# Altium project Interface Panel(Display).PrjPcb
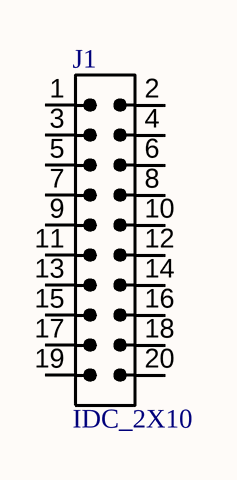
[diagram p0: JTAG.SchDoc]
4 sheets, 26 parts. Net scope: global (net labels, ports and power ports of the same name join across sheets).
Board file: PCB_V0.0.PcbDoc
Sheets:
  JTAG.SchDoc
  Disp.SchDoc
  screw and Hole.SchDoc
  On Board Terminal.SchDoc

## Sheet JTAG.SchDoc
size 297 x 209 mm; SheetNumber: 1; SheetTotal: 3

### Parts
J1  IDC_2X10  [IDC_2X10]

### Nets

Not connected (* = marked no-connect by the designer): J1 1 2 3 4 5 6 7 8 9 10 11 12 13 14 15 16 17 18 19 20

### Notes on the sheet
- Drawn
- Name
- Date
- Drawing Title
- Checked
- Drawing No.
- Approved
- Size
- A4
- Ver.
- Rev.
- Sheet
- Of

### Library data of the parts
J1 = IDC_2X10: CONN, IDC, Male, pitch: 2.54mm, 20POS; VALUE: IDC_2X10

## Sheet Disp.SchDoc
size 297 x 209 mm; SheetNumber: 2; SheetTotal: 4
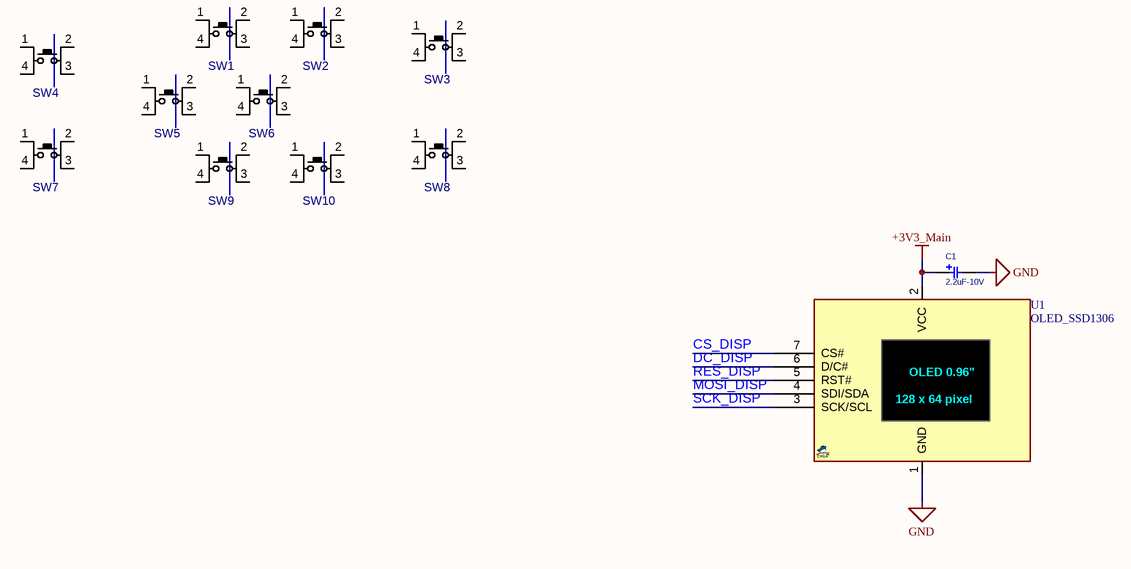
[diagram p1: Disp.SchDoc]

### Parts
C1  2.2uF-10V  [C_TN_3216]
SW1  PUSHBUTTON  [SWPBS_SPDT_6X6X4]  (value not drawn)
SW2  PUSHBUTTON  [SWPBS_SPDT_6X6X4]  (value not drawn)
SW3  PUSHBUTTON  [SWPBS_SPDT_6X6X4]  (value not drawn)
SW4  PUSHBUTTON  [SWPBS_SPDT_3X3TS]  (value not drawn)
SW5  PUSHBUTTON  [SWPBS_SPDT_6X6X4]  (value not drawn)
SW6  PUSHBUTTON  [SWPBS_SPDT_6X6X4]  (value not drawn)
SW7  PUSHBUTTON  [SWPBS_SPDT_3X3TS]  (value not drawn)
SW8  PUSHBUTTON  [SWPBS_SPDT_6X6X4]  (value not drawn)
SW9  PUSHBUTTON  [SWPBS_SPDT_6X6X4]  (value not drawn)
SW10  PUSHBUTTON  [SWPBS_SPDT_6X6X4]  (value not drawn)
U1  OLED_SSD1306  [OLED_SSD1306_64_SPI]

### Nets
+3V3_Main: C1.1 U1.2(VCC)
GND: C1.2 U1.1(GND)
CS_DISP: U1.7(CS#)
DC_DISP: U1.6(D/C#)
MOSI_DISP: U1.4(SDI/SDA)
RES_DISP: U1.5(RST#)
SCK_DISP: U1.3(SCK/SCL)

Not connected (* = marked no-connect by the designer): SW1 1(P1) 2(P3) 3(P4) 4(P2); SW2 1(P1) 2(P3) 3(P4) 4(P2); SW3 1(P1) 2(P3) 3(P4) 4(P2); SW4 1(P1) 2(P3) 3(P4) 4(P2); SW5 1(P1) 2(P3) 3(P4) 4(P2); SW6 1(P1) 2(P3) 3(P4) 4(P2); SW7 1(P1) 2(P3) 3(P4) 4(P2); SW8 1(P1) 2(P3) 3(P4) 4(P2); SW9 1(P1) 2(P3) 3(P4) 4(P2); SW10 1(P1) 2(P3) 3(P4) 4(P2)

### Notes on the sheet
- Drawn
- Name
- Date
- Drawing Title
- Checked
- Drawing No.
- Approved
- Size
- A4
- Ver.
- Rev.
- Sheet
- Of
- (in symbol OLED_SSD1306_64_SPI) OLED 0.96"; 128 x 64 pixel

### Library data of the parts
C1 = CAP_SMD_TAN: CAP, SMD, TAN,; PARAM2: -V; VALUE: 2.2uF-10V
SW1-SW3 SW5 SW6 SW8-SW10 = SWPBS_SPDT_6X6X4: SWITCH, PUSH BUTTON, TACTILE, SMD, SPDT, 6X6X4.3mm; MANF: Bond-Tact; DESC: DESCRIPTION; MANF_P#: TS-1143S; VALUE: PUSHBUTTON; ASSEMBLY: ASSEMBLY; PARAM: PARAM; PRICE: PRICE
SW4 SW7 = SWPBS_SPDT_3X3TS: SWITCH, PUSH BUTTON, TACTILE, SMD, SPDT, 3X3MM; MANF: CHINA; DESC: DESCRIPTION; MANF_P#: TS-1233; VALUE: PUSHBUTTON; ASSEMBLY: ASSEMBLY; PARAM: PARAM; PRICE: 1000= 5$
U1 = OLED_SSD1306_64_SPI: OLED, SSD1306, 0.96", 128X64, BREAKOUT SPI; MANF_P#: OLED_SSD1306_I2C; PARAM2: 3.3/5VCC, -20~70oC; PARAM: 2 Colors, 0.96", 128X64; MANF: -; VALUE: OLED_SSD1306

## Sheet screw and Hole.SchDoc
size 297 x 209 mm; SheetNumber: 3; SheetTotal: 4
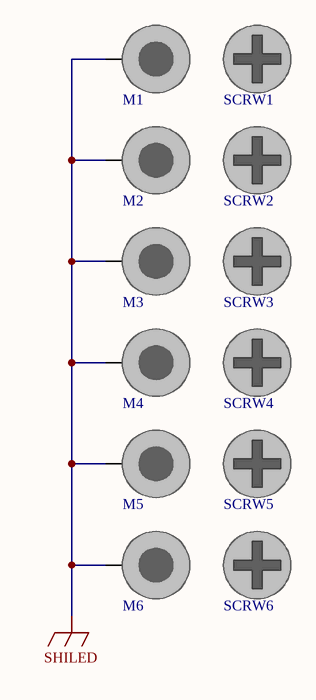
[diagram p2: screw and Hole.SchDoc]

### Parts
M1  DNP/MH  [SCMH_M2]  (value not drawn)  (no BOM)
M2  DNP/MH  [SCMH_M2]  (value not drawn)  (no BOM)
M3  DNP/MH  [SCMH_M2]  (value not drawn)  (no BOM)
M4  DNP/MH  [SCMH_M2]  (value not drawn)  (no BOM)
M5  DNP/MH  [SCMH_M2]  (value not drawn)  (no BOM)
M6  DNP/MH  [SCMH_M2]  (value not drawn)  (no BOM)
SCRW1  SCREW  [SCRW_CHSH_PHLIPS_M2X4]  (value not drawn)
SCRW2  SCREW  [SCRW_CHSH_PHLIPS_M2X4]  (value not drawn)
SCRW3  SCREW  [SCRW_CHSH_PHLIPS_M2X4]  (value not drawn)
SCRW4  SCREW  [SCRW_CHSH_PHLIPS_M2X4]  (value not drawn)
SCRW5  SCREW  [SCRW_CHSH_PHLIPS_M2X4]  (value not drawn)
SCRW6  SCREW  [SCRW_CHSH_PHLIPS_M2X4]  (value not drawn)

### Nets
SHILED: M1.1 M2.1 M3.1 M4.1 M5.1 M6.1

### Notes on the sheet
- Drawn
- Name
- Date
- Drawing Title
- Checked
- Drawing No.
- Approved
- Size
- A4
- Ver.
- Rev.
- Sheet
- Of

### Library data of the parts
M1-M6 = SCMH_M2: SCREW mouting, M2, 2.0mm diameter and 4.0mm PanHead; ASSEMBLY: DNP; VALUE: DNP/MH
SCRW1-SCRW6 = SCRW_CHSH_PHLIPS_M2X4: SCREW, M2, 2.0mm diameter and 4.0mm PanHead; ASSEMBLY: DNP; VALUE: SCREW

## Sheet On Board Terminal.SchDoc
size 297 x 209 mm; SheetNumber: 4; SheetTotal: 4
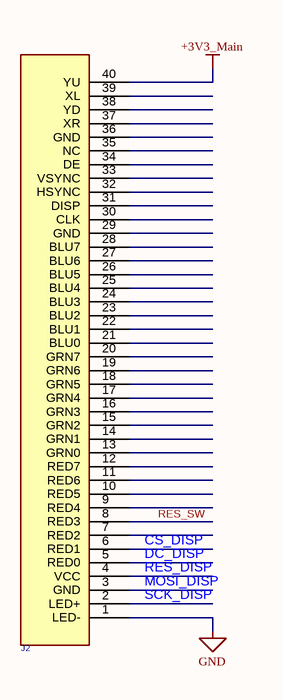
[diagram p3: On Board Terminal.SchDoc]

### Parts
J2  FPC50 40  [FPC50_40]  (value not drawn)

### Nets
+3V3_Main: J2.40(YU)
GND: J2.1(LED-)
CS_DISP: J2.6(RED1)
DC_DISP: J2.5(RED0)
MOSI_DISP: J2.3(GND)
RES_DISP: J2.4(VCC)
RES_SW: J2.8(RED3)
SCK_DISP: J2.2(LED+)

Not connected (* = marked no-connect by the designer): J2 7(RED2) 9(RED4) 10(RED5) 11(RED6) 12(RED7) 13(GRN0) 14(GRN1) 15(GRN2) 16(GRN3) 17(GRN4) 18(GRN5) 19(GRN6) 20(GRN7) 21(BLU0) 22(BLU1) 23(BLU2) 24(BLU3) 25(BLU4) 26(BLU5) 27(BLU6) 28(BLU7) 29(GND) 30(CLK) 31(DISP) 32(HSYNC) 33(VSYNC) 34(DE) 35(NC) 36(GND) 37(XR) 38(YD) 39(XL)

### Notes on the sheet
- Drawn
- Name
- Date
- Drawing Title
- Checked
- Drawing No.
- Approved
- Size
- A4
- Ver.
- Rev.
- Sheet
- Of

### Library data of the parts
J2 = FPC50 40: CONN, FPC, 0.50mm pitch, RightAngle, Bot. Contact; ComponentLink1Description: Website Smart World; ComponentLink1URL: https://www.smartw.ir/; ComponentLink2Description: Telegram; ComponentLink2URL: https://t.me/altium_smartw; ComponentLink3Description: Instagram; ComponentLink3URL: https://Instagram.com/smartgw.ir; DatasheetVersion: 2021

## Nets that join several sheets
+3V3_Main: Disp (C1.1 U1.2), On Board Terminal (J2.40)
GND: Disp (C1.2 U1.1), On Board Terminal (J2.1)
CS_DISP: Disp (U1.7), On Board Terminal (J2.6)
DC_DISP: Disp (U1.6), On Board Terminal (J2.5)
MOSI_DISP: Disp (U1.4), On Board Terminal (J2.3)
RES_DISP: Disp (U1.5), On Board Terminal (J2.4)
SCK_DISP: Disp (U1.3), On Board Terminal (J2.2)